# Altium schematic sheet LaserWater.SchDoc
size A
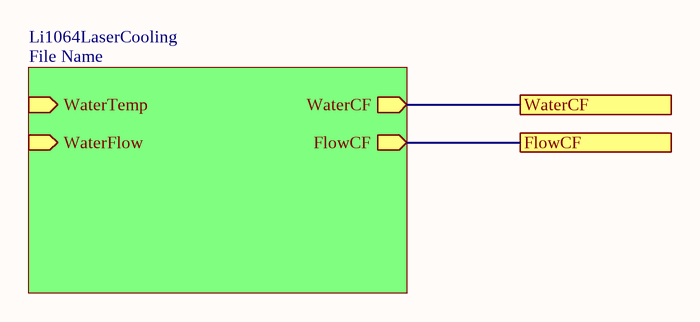
[diagram p0: LaserWater.SchDoc]

## Sub-sheets
Li1064LaserCooling = File Name: WaterTemp (in), WaterFlow (in), WaterCF (out), FlowCF (out)

## Ports
FlowCF, WaterCF

## Nets
FlowCF: port FlowCF, sheet Li1064LaserCooling/FlowCF
WaterCF: port WaterCF, sheet Li1064LaserCooling/WaterCF